# Altium project OpAmpNorton.PRJPCB
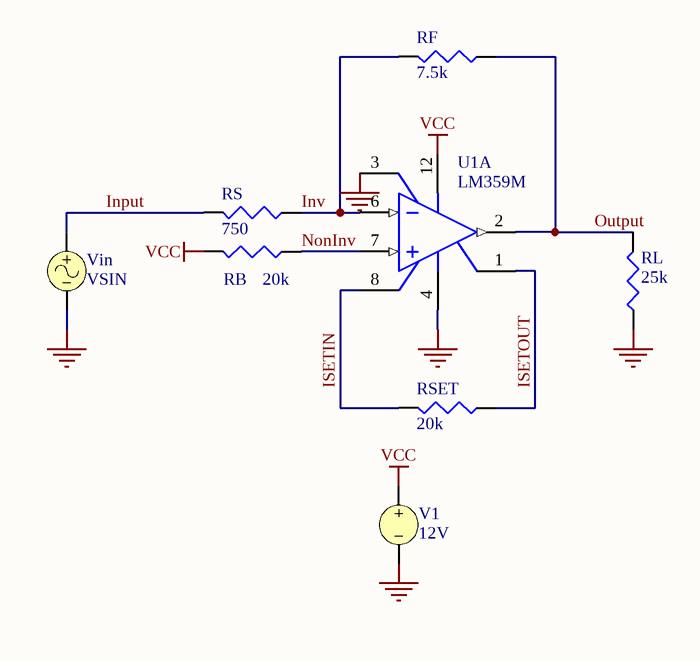
[diagram p0: OpAmpNorton.schdoc]
1 sheet, 8 parts. Net scope: global (net labels, ports and power ports of the same name join across sheets).

## Sheet OpAmpNorton.schdoc: Analog Amplifier
size A4; Organization: Altium Limited; Address1: L3, 12a Rodborough Rd; Address2: Frenchs Forest; Address3: NSW; Address4: Australia 2086; DocumentNumber: 1; SheetNumber: 1; SheetTotal: 1

### Parts
RB  value 20k  (hidden comment: 10k)
RF  value 7.5k  (hidden comment: 100k)
RL  25k
RS  value 750  (hidden comment: 10k)
RSET  value 20k  (hidden comment: 25k)
U1  LM359M  [M14A_N]  (part A of 3)
V1  12V
Vin  VSIN

### Nets
GND: RL.2(BOT) U1.3(COMPA) U1.4(GNDA) V1.2 Vin.2
VCC: RB.1(TOP) U1.12(V+) V1.1
Input: RS.1(TOP) Vin.1
Inv: RF.1(TOP) RS.2(BOT) U1.6(INA-)
ISETIN: RSET.1(TOP) U1.8(ISET(IN))
ISETOUT: RSET.2(BOT) U1.1(ISET(OUT))
NonInv: RB.2(BOT) U1.7(INA+)
Output: RF.2(BOT) RL.1(TOP) U1.2(OUTA)

### Notes on the sheet
- Title
- Size:
- Date:
- A4
- Number:
- Time:
- Revision:
- Sheet
- of
- File:

### Library data of the parts
RB RF RL RS RSET = RES: Resistor
  RL: Value: 25k
U1 = LM359M: Dual, High Speed, Programmable, Current Mode (Norton) Amplifiers; Manufacturer: National Semiconductor; PackageTopMarking: NSUZXYTT*LM359M; Published: 4-Dec-2008; DatasheetVersion: Aug-2000; PackageVersion: revJ, Jan-1996; PackageReference: M14A; Publisher: Altium Limited; PackageDescription: Molded Package S.O., .150in Wide, 14 Lead; CompType: Amplifiers; PartNumber: LM359M; RoHS: O; PinCount: 14; DigiKeyPartNumber: LM359M-ND; Code_JEDEC: MS-012AB; Code_IPC: SOIC127P600-14; ComponentLink1Description: LM359 Datasheet; ComponentLink1URL: http://www.national.com/ds/LM/LM359.pdf; ComponentLink2Description: LM359 Web Page; ComponentLink2URL: http://www.national.com/pf/LM/LM359.html; ComponentLink3Description: M14A Package Page; ComponentLink3URL: http://www.national.com/packaging/folders/m14a.html; DeviceFunction: Amplifier
V1 = VSRC: Voltage Source; Value: 12V
Vin = VSIN: Sinusoidal Voltage Source